# Altium project Diploma.PrjPcb
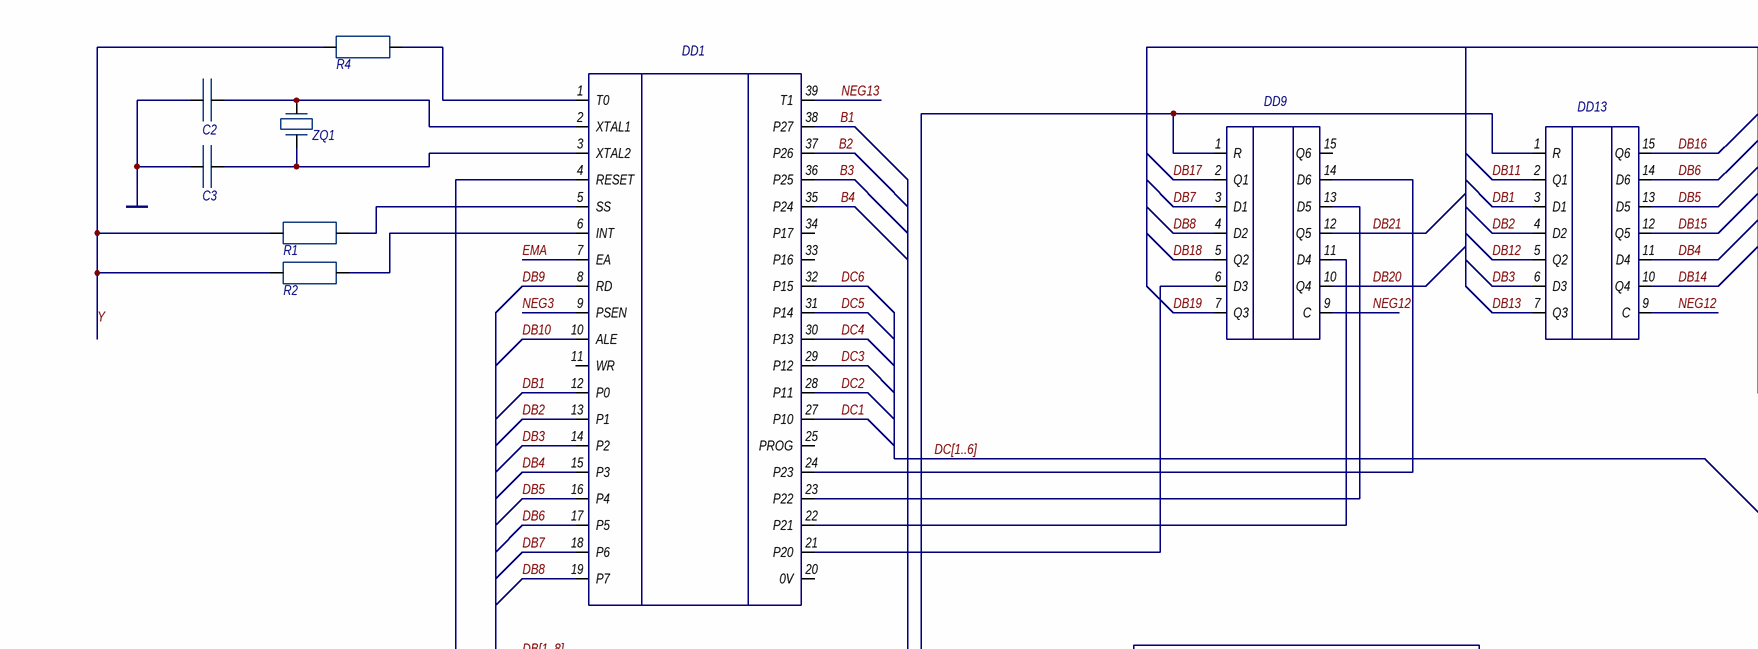
[diagram p0: SHEMPEL.SchDoc, top left]
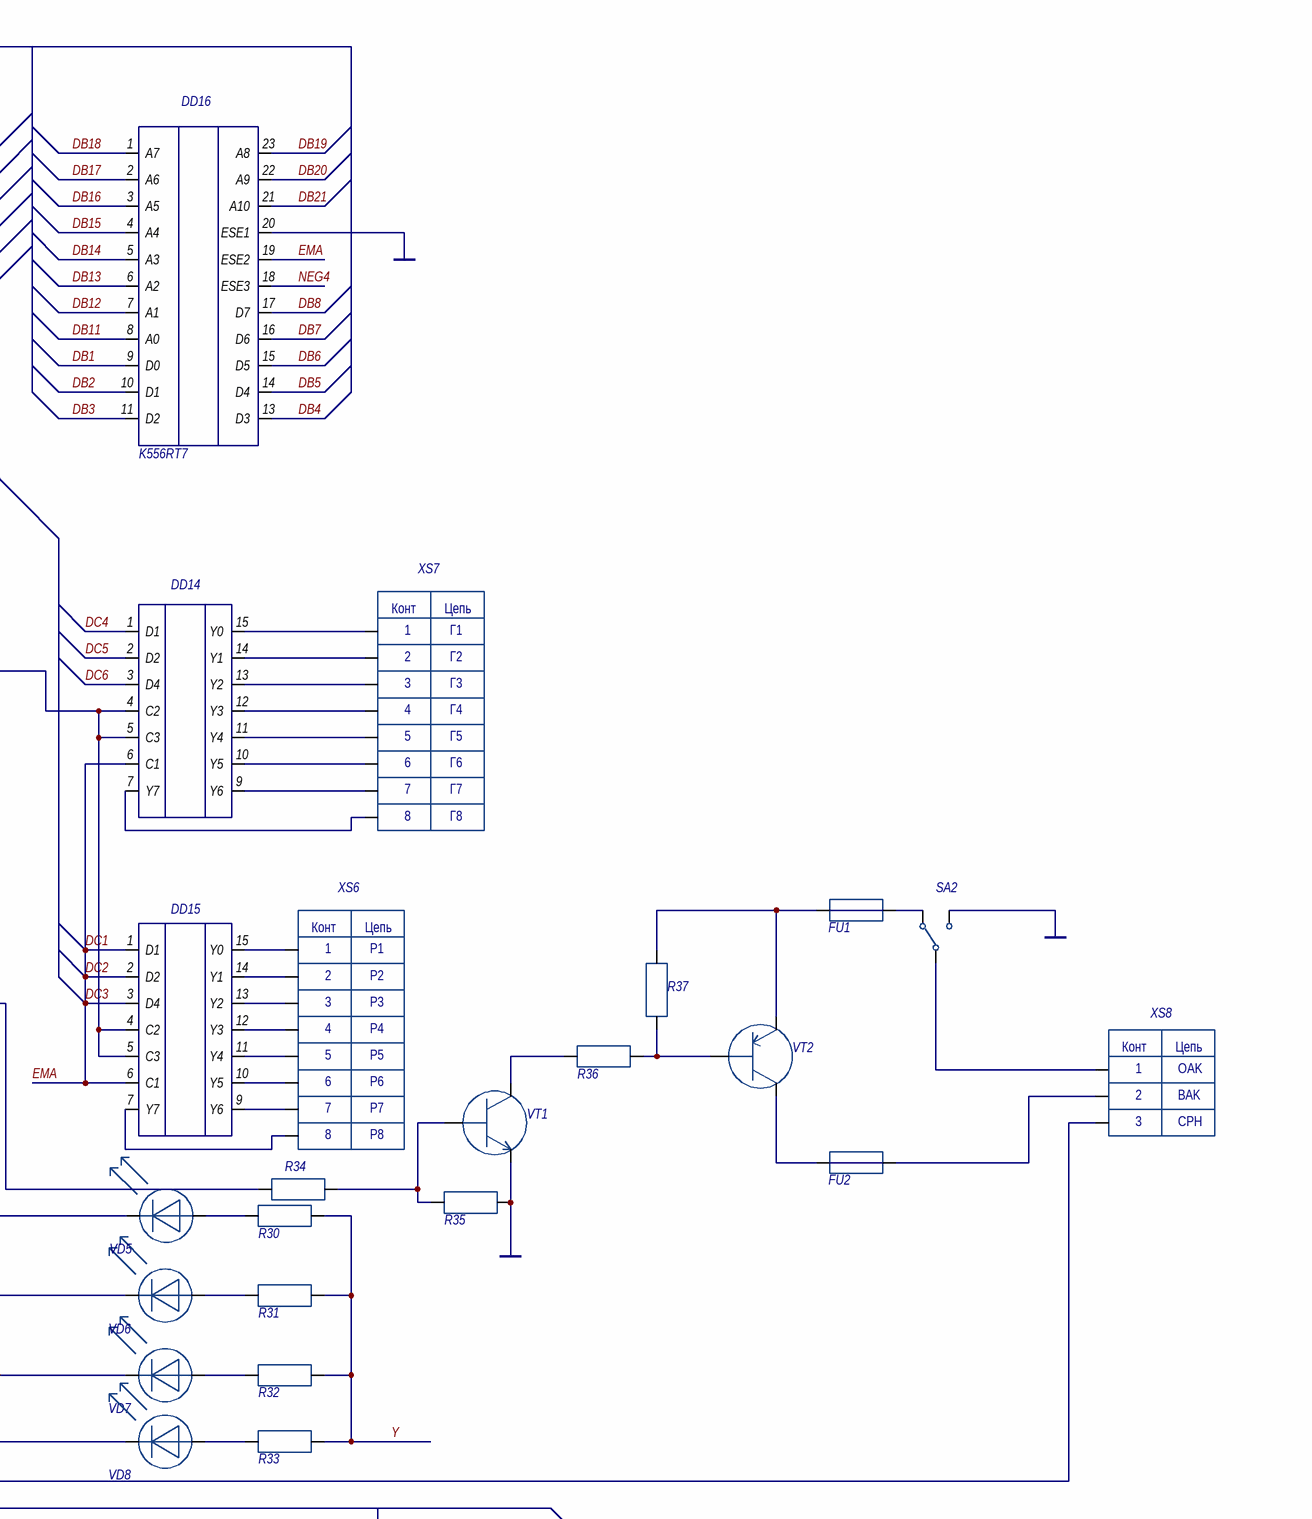
[diagram p1: SHEMPEL.SchDoc, top right]
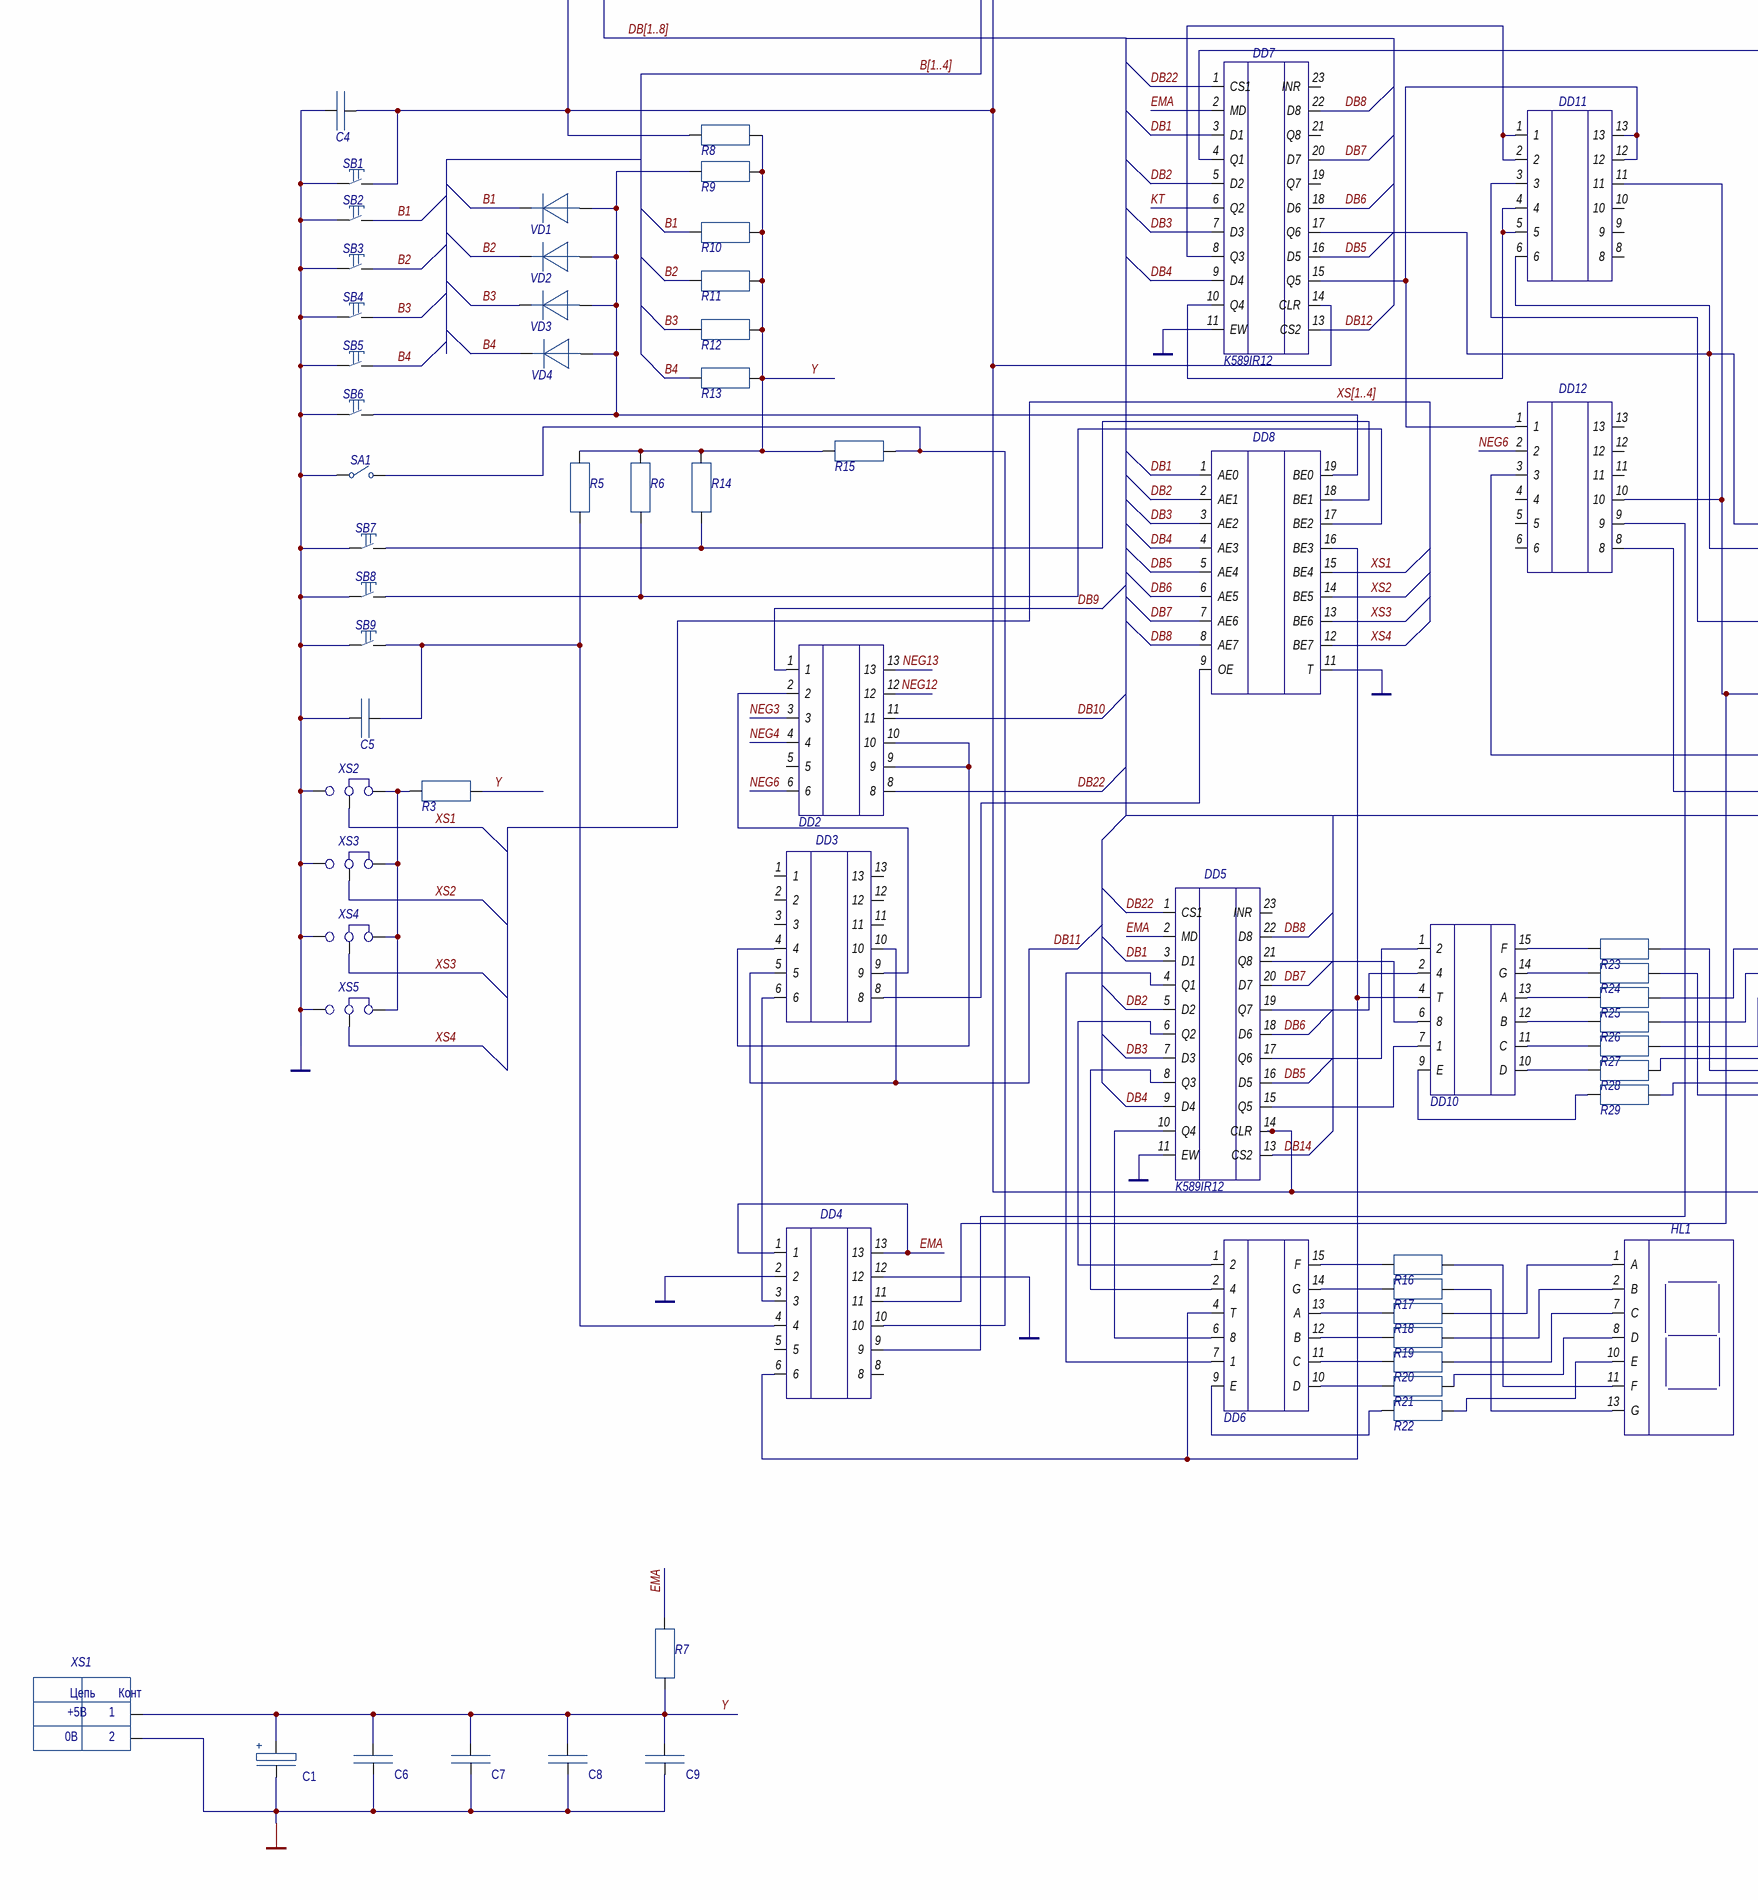
[diagram p2: SHEMPEL.SchDoc, bottom left]
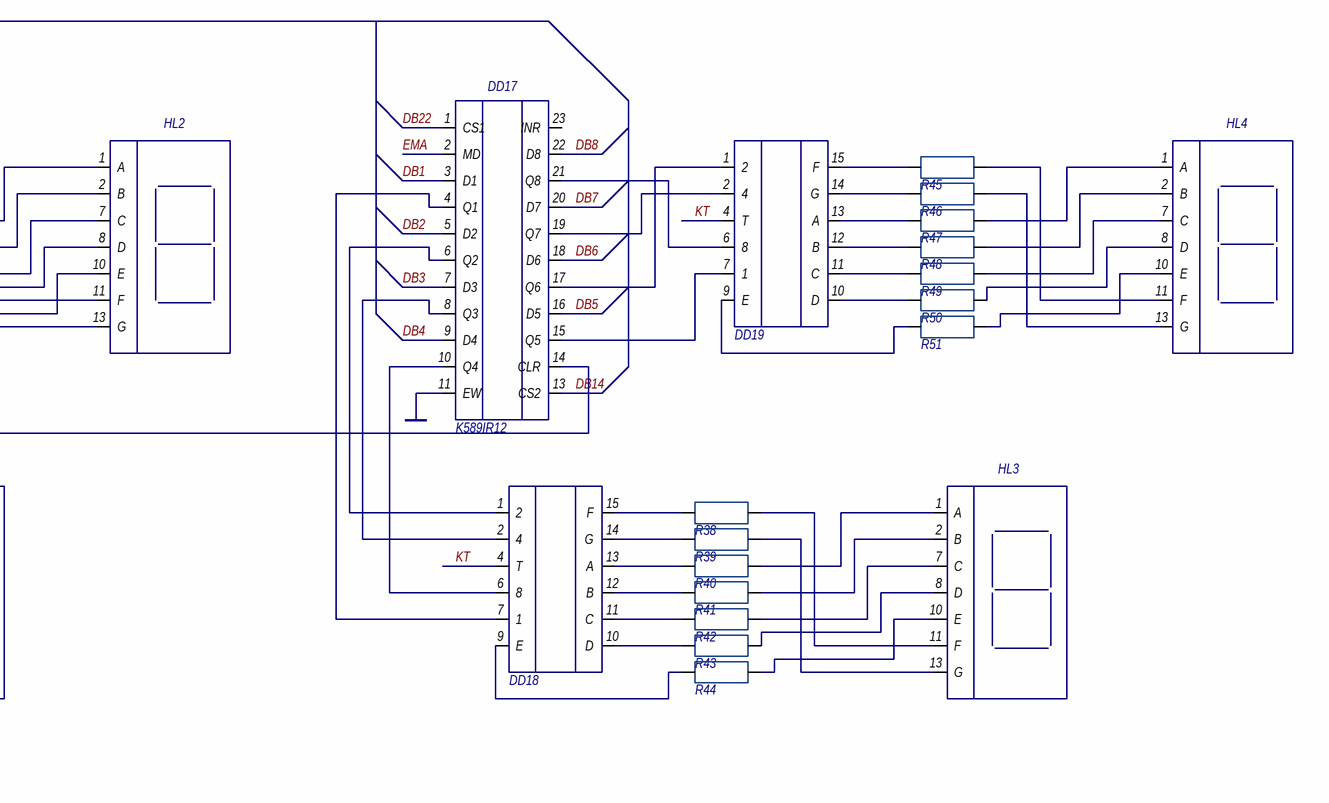
[diagram p3: SHEMPEL.SchDoc, bottom right]
1 sheet, 115 parts. Net scope: global (net labels, ports and power ports of the same name join across sheets).
Board file: main.PcbDoc

## Sheet SHEMPEL.SchDoc
size 840 x 594 mm; ListNumber: 1

### Parts
C1  pol_1mkF  [PCAP_6_3x11THRU-ELECT_NCA]  (value not drawn)
C2  33pF  [CAP_0805_GRM]  (value not drawn)
C3  33pF  [CAP_0805_GRM]  (value not drawn)
C4  33pF  [CAP_0805_GRM]  (value not drawn)
C5  33pF  [CAP_0805_GRM]  (value not drawn)
C6  cap_1mkF  [CAP_0805_GRM]  (value not drawn)
C7  cap_1mkF  [CAP_0805_GRM]  (value not drawn)
C8  cap_1mkF  [CAP_0805_GRM]  (value not drawn)
C9  cap_1mkF  [CAP_0805_GRM]  (value not drawn)
DD1  KR1850VE35  [DIP-40]  (value not drawn)
DD2  K533LN1  [SO-14-K533LA3]  (value not drawn)
DD3  K533LA3  [SO-14-K533LA3]  (value not drawn)
DD4  KR1533TM2  [dip-14]  (value not drawn)
DD5  K589IR12  [DIP-24-KR556RT7]
DD6  K514ID2  [dip-14]  (value not drawn)
DD7  K589IR12  [DIP-24-KR556RT7]
DD8  KR580BA86  [DIP-20]  (value not drawn)
DD9  KR1533TM9  [DIP-16]  (value not drawn)
DD10  K514ID2  [dip-14]  (value not drawn)
DD11  KR1533LA9  [dip-14]  (value not drawn)
DD12  KR1533LA9  [dip-14]  (value not drawn)
DD13  KR1533TM9  [DIP-16]  (value not drawn)
DD14  KR1533ID7  [DIP-16]  (value not drawn)
DD15  KR1533ID7  [DIP-16]  (value not drawn)
DD16  K556RT7  [DIP-24-KR556RT7]
DD17  K589IR12  [DIP-24-KR556RT7]
DD18  K514ID2  [dip-14]  (value not drawn)
DD19  K514ID2  [dip-14]  (value not drawn)
FU1  fu  [FERRIT_BEAD_C2012X105N]  (value not drawn)
FU2  fu  [FERRIT_BEAD_C2012X105N]  (value not drawn)
HL1  semisigment  [LDS-C302RI_10P18X19P10_LUM]  (value not drawn)
HL2  semisigment  [LDS-C302RI_10P18X19P10_LUM]  (value not drawn)
HL3  semisigment  [LDS-C302RI_10P18X19P10_LUM]  (value not drawn)
HL4  semisigment  [LDS-C302RI_10P18X19P10_LUM]  (value not drawn)
R1  res_510  [RES_RC0805]  (value not drawn)
R2  res_510  [RES_RC0805]  (value not drawn)
R3  res_510  [RES_RC0805]  (value not drawn)
R4  res_510  [RES_RC0805]  (value not drawn)
R5  res_510  [RES_RC0805]  (value not drawn)
R6  res_510  [RES_RC0805]  (value not drawn)
R7  res_510  [RES_RC0805]  (value not drawn)
R8  res_510  [RES_RC0805]  (value not drawn)
R9  res_510  [RES_RC0805]  (value not drawn)
R10  res_510  [RES_RC0805]  (value not drawn)
R11  res_510  [RES_RC0805]  (value not drawn)
R12  res_510  [RES_RC0805]  (value not drawn)
R13  res_510  [RES_RC0805]  (value not drawn)
R14  res_510  [RES_RC0805]  (value not drawn)
R15  res_510  [RES_RC0805]  (value not drawn)
R16  res_510  [RES_RC0805]  (value not drawn)
R17  res_510  [RES_RC0805]  (value not drawn)
R18  res_510  [RES_RC0805]  (value not drawn)
R19  res_510  [RES_RC0805]  (value not drawn)
R20  res_510  [RES_RC0805]  (value not drawn)
R21  res_510  [RES_RC0805]  (value not drawn)
R22  res_510  [RES_RC0805]  (value not drawn)
R23  res_510  [RES_RC0805]  (value not drawn)
R24  res_510  [RES_RC0805]  (value not drawn)
R25  res_510  [RES_RC0805]  (value not drawn)
R26  res_510  [RES_RC0805]  (value not drawn)
R27  res_510  [RES_RC0805]  (value not drawn)
R28  res_510  [RES_RC0805]  (value not drawn)
R29  res_510  [RES_RC0805]  (value not drawn)
R30  res_510  [RES_RC0805]  (value not drawn)
R31  res_510  [RES_RC0805]  (value not drawn)
R32  res_510  [RES_RC0805]  (value not drawn)
R33  res_510  [RES_RC0805]  (value not drawn)
R34  res_510  [RES_RC0805]  (value not drawn)
R35  res_510  [RES_RC0805]  (value not drawn)
R36  res_510  [RES_RC0805]  (value not drawn)
R37  res_510  [RES_RC0805]  (value not drawn)
R38  res_510  [RES_RC0805]  (value not drawn)
R39  res_510  [RES_RC0805]  (value not drawn)
R40  res_510  [RES_RC0805]  (value not drawn)
R41  res_510  [RES_RC0805]  (value not drawn)
R42  res_510  [RES_RC0805]  (value not drawn)
R43  res_510  [RES_RC0805]  (value not drawn)
R44  res_510  [RES_RC0805]  (value not drawn)
R45  res_510  [RES_RC0805]  (value not drawn)
R46  res_510  [RES_RC0805]  (value not drawn)
R47  res_510  [RES_RC0805]  (value not drawn)
R48  res_510  [RES_RC0805]  (value not drawn)
R49  res_510  [RES_RC0805]  (value not drawn)
R50  res_510  [RES_RC0805]  (value not drawn)
R51  res_510  [RES_RC0805]  (value not drawn)
SA1  sw-spst  [SW-SPST]  (value not drawn)
SA2  sw-spdt  [SW-SPDT]  (value not drawn)
SB1  button_keypad  [button_SW_1571527-1]  (value not drawn)
SB2  button_keypad  [button_SW_1571527-1]  (value not drawn)
SB3  button_keypad  [button_SW_1571527-1]  (value not drawn)
SB4  button_keypad  [button_SW_1571527-1]  (value not drawn)
SB5  button_keypad  [button_SW_1571527-1]  (value not drawn)
SB6  button_keypad  [button_SW_1571527-1]  (value not drawn)
SB7  button_keypad  [button_SW_1571527-1]  (value not drawn)
SB8  button_keypad  [button_SW_1571527-1]  (value not drawn)
SB9  button_keypad  [button_SW_1571527-1]  (value not drawn)
VD1  M7  [M7_DO-214AC_DTC]  (value not drawn)
VD2  M7  [M7_DO-214AC_DTC]  (value not drawn)
VD3  M7  [M7_DO-214AC_DTC]  (value not drawn)
VD4  M7  [M7_DO-214AC_DTC]  (value not drawn)
VD5  red_GNL-3012HD  [LED_151054RS03000]  (value not drawn)
VD6  red_GNL-3012HD  [LED_151054RS03000]  (value not drawn)
VD7  red_GNL-3012HD  [LED_151054RS03000]  (value not drawn)
VD8  red_GNL-3012HD  [LED_151054RS03000]  (value not drawn)
VT1  BC547  [TO-92-3_ONS]  (value not drawn)
VT2  trans  [TO-92-3_ONS]  (value not drawn)
XS1  conn_power_jack  [PJ-037AH]  (value not drawn)
XS2  switcher  [conn_3pin_TSW-103-05-G-S]  (value not drawn)
XS3  switcher  [conn_3pin_TSW-103-05-G-S]  (value not drawn)
XS4  switcher  [conn_3pin_TSW-103-05-G-S]  (value not drawn)
XS5  switcher  [conn_3pin_TSW-103-05-G-S]  (value not drawn)
XS6  conn_8pin_P  [conn_8pin_TSW-108-05-G-S]  (value not drawn)
XS7  conn_8_pin_G  [conn_8pin_TSW-108-05-G-S]  (value not drawn)
XS8  conn_3_OAK_BAK_CPH  [conn_3pin_TSW-103-05-G-S]  (value not drawn)
ZQ1  HC-49S  [CRYSTAL_HC49S_MTC]  (value not drawn)

### Nets
GND: C1.1 C2.1 C3.1 C4.1 C5.1 C6.1 C7.1 C8.1 C9.1 DD4.2 DD4.12 DD5.11(EW) DD7.11(EW) DD8.11(T) DD16.20(ESE1) DD17.11(EW) R35.2 SA1.1 SA2.1 SB1.1 SB2.1 SB3.1 SB4.1 SB5.1 SB6.1 SB7.1 SB8.1 SB9.1 VT1.1(E) XS1.2(VDD) XS2.1 XS3.1 XS4.1 XS5.1
B1: DD1.38(P27) R10.1 SB2.2 VD1.2
B2: DD1.37(P26) R11.1 SB3.2 VD2.2
B3: DD1.36(P25) R12.1 SB4.2 VD3.2
B4: DD1.35(P24) R13.1 SB5.2 VD4.2
DB1: DD1.12(P0) DD5.3(D1) DD7.3(D1) DD8.1(AE0) DD13.3(D1) DD16.9(D0) DD17.3(D1)
DB2: DD1.13(P1) DD5.5(D2) DD7.5(D2) DD8.2(AE1) DD13.4(D2) DD16.10(D1) DD17.5(D2)
DB3: DD1.14(P2) DD5.7(D3) DD7.7(D3) DD8.3(AE2) DD13.6(D3) DD16.11(D2) DD17.7(D3)
DB4: DD1.15(P3) DD5.9(D4) DD7.9(D4) DD8.4(AE3) DD13.11(D4) DD16.13(D3) DD17.9(D4)
DB5: DD1.16(P4) DD5.16(D5) DD7.16(D5) DD8.5(AE4) DD13.13(D5) DD16.14(D4) DD17.16(D5)
DB6: DD1.17(P5) DD5.18(D6) DD7.18(D6) DD8.6(AE5) DD13.14(D6) DD16.15(D5) DD17.18(D6)
DB7: DD1.18(P6) DD5.20(D7) DD7.20(D7) DD8.7(AE6) DD9.3(D1) DD16.16(D6) DD17.20(D7)
DB8: DD1.19(P7) DD5.22(D8) DD7.22(D8) DD8.8(AE7) DD9.4(D2) DD16.17(D7) DD17.22(D8)
DB9: DD1.8(RD) DD2.1
DB10: DD1.10(ALE) DD2.11
DB11: DD3.5 DD3.10 DD13.2(Q1) DD16.8(A0)
DB12: DD7.13(CS2) DD13.5(Q2) DD16.7(A1)
DB13: DD13.7(Q3) DD16.6(A2)
DB14: DD5.13(CS2) DD13.10(Q4) DD16.5(A3) DD17.13(CS2)
DB15: DD13.12(Q5) DD16.4(A4)
DB16: DD13.15(Q6) DD16.3(A5)
DB17: DD9.2(Q1) DD16.2(A6)
DB18: DD9.5(Q2) DD16.1(A7)
DB19: DD9.7(Q3) DD16.23(A8)
DB20: DD9.10(Q4) DD16.22(A9)
DB21: DD9.12(Q5) DD16.21(A10)
DB22: DD2.8 DD5.1(CS1) DD7.1(CS1) DD17.1(CS1)
DC1: DD1.7(EA) DD1.27(P10) DD1.28(P11) DD1.29(P12) DD4.1 DD4.13 DD5.2(MD) DD7.2(MD) DD14.6(C1) DD15.1(D1) DD15.2(D2) DD15.3(D4) DD15.6(C1) DD16.19(ESE2) DD17.2(MD) R7.2  [also labelled DC2, DC3, EMA]
DC4: DD1.30(P13) DD14.1(D1)
DC5: DD1.31(P14) DD14.2(D2)
DC6: DD1.32(P15) DD14.3(D4)
KT: DD7.6(Q2) DD18.4(T) DD19.4(T)
NEG3: DD1.9(PSEN) DD2.3
NEG4: DD2.4 DD16.18(ESE3)
NEG6: DD2.6 DD12.2
NEG12: DD2.12 DD9.9(C) DD13.9(C)
NEG13: DD1.39(T1) DD2.13
XS1: DD8.15(BE4) XS2.3
XS2: DD8.14(BE5) XS3.3
XS3: DD8.13(BE6) XS4.3
XS4: DD8.12(BE7) XS5.3
Y: C1.2 C6.2 C7.2 C8.2 C9.2 R1.1 R2.1 R3.2 R4.1 R5.2 R6.2 R7.1 R8.2 R9.2 R10.2 R11.2 R12.2 R13.2 R14.2 R15.1 R30.2 R31.2 R32.2 R33.2 XS1.1(VSS)
NetC2_2: C2.2 DD1.2(XTAL1) ZQ1.2
NetC3_2: C3.2 DD1.3(XTAL2) ZQ1.1
NetC4_2: C4.2 DD1.4(RESET) DD5.14(CLR) DD7.14(CLR) DD9.1(R) DD13.1(R) DD17.14(CLR) R8.1 SB1.2
NetC5_2: C5.2 DD4.4 R5.1 SB9.2
NetDD1_1: DD1.1(T0) R4.2
NetDD1_5: DD1.5(SS) R1.2
NetDD1_6: DD1.6(INT) R2.2
NetDD1_21: DD1.21(P20) DD9.6(D3)
NetDD1_22: DD1.22(P21) DD9.11(D4)
NetDD1_23: DD1.23(P22) DD9.13(D5)
NetDD1_24: DD1.24(P23) DD9.14(D6)
NetDD2_2: DD2.2 DD3.9
NetDD2_9: DD2.9 DD2.10 DD3.4
NetDD3_6: DD3.6 DD4.3
NetDD3_8: DD3.8 DD8.9(OE)
NetDD4_6: DD4.6 DD6.4(T) DD8.16(BE3) DD10.4(T)
NetDD4_9: DD4.9 DD12.9
NetDD4_10: DD4.10 R15.2 SA1.2
NetDD4_11: DD4.11 DD11.11 DD12.10 VD7.2
NetDD5_4: DD5.4(Q1) DD6.7(1)
NetDD5_6: DD5.6(Q2) DD6.1(2)
NetDD5_8: DD5.8(Q3) DD6.2(4)
NetDD5_10: DD5.10(Q4) DD6.6(8)
NetDD5_15: DD5.15(Q5) DD10.7(1)
NetDD5_17: DD5.17(Q6) DD10.1(2)
NetDD5_19: DD5.19(Q7) DD10.2(4)
NetDD5_21: DD5.21(Q8) DD10.6(8)
NetDD6_9: DD6.9(E) R22.1
NetDD6_10: DD6.10(D) R21.1
NetDD6_11: DD6.11(C) R20.1
NetDD6_12: DD6.12(B) R19.1
NetDD6_13: DD6.13(A) R18.1
NetDD6_14: DD6.14(G) R17.1
NetDD6_15: DD6.15(F) R16.1
NetDD7_4: DD7.4(Q1) DD14.4(C2) DD14.5(C3) DD15.4(C2) DD15.5(C3)
NetDD7_8: DD7.8(Q3) DD11.1 DD11.2
NetDD7_10: DD7.10(Q4) DD11.4 DD11.5
NetDD7_15: DD7.15(Q5) DD11.12 DD11.13 DD12.1
NetDD7_17: DD7.17(Q6) DD11.6 R34.1 VD5.2
NetDD8_17: DD8.17(BE2) R6.1 SB8.2
NetDD8_18: DD8.18(BE1) R14.1 SB7.2
NetDD8_19: DD8.19(BE0) R9.1 SB6.2 VD1.1 VD2.1 VD3.1 VD4.1
NetDD10_9: DD10.9(E) R29.1
NetDD10_10: DD10.10(D) R28.1
NetDD10_11: DD10.11(C) R27.1
NetDD10_12: DD10.12(B) R26.1
NetDD10_13: DD10.13(A) R25.1
NetDD10_14: DD10.14(G) R24.1
NetDD10_15: DD10.15(F) R23.1
NetDD11_3: DD11.3 VD6.2
NetDD12_3: DD12.3 VD8.2
NetDD12_8: DD12.8 XS8.3
NetDD14_7: DD14.7(Y7) XS7.8
NetDD14_9: DD14.9(Y6) XS7.7(D0)
NetDD14_10: DD14.10(Y5) XS7.6(*WR)
NetDD14_11: DD14.11(Y4) XS7.5(*RD)
NetDD14_12: DD14.12(Y3) XS7.4(C/D)
NetDD14_13: DD14.13(Y2) XS7.3(VO)
NetDD14_14: DD14.14(Y1) XS7.2(VDD)
NetDD14_15: DD14.15(Y0) XS7.1(VSS)
NetDD15_7: DD15.7(Y7) XS6.8
NetDD15_9: DD15.9(Y6) XS6.7(D0)
NetDD15_10: DD15.10(Y5) XS6.6(*WR)
NetDD15_11: DD15.11(Y4) XS6.5(*RD)
NetDD15_12: DD15.12(Y3) XS6.4(C/D)
NetDD15_13: DD15.13(Y2) XS6.3(VO)
NetDD15_14: DD15.14(Y1) XS6.2(VDD)
NetDD15_15: DD15.15(Y0) XS6.1(VSS)
NetDD17_4: DD17.4(Q1) DD18.7(1)
NetDD17_6: DD17.6(Q2) DD18.1(2)
NetDD17_8: DD17.8(Q3) DD18.2(4)
NetDD17_10: DD17.10(Q4) DD18.6(8)
NetDD17_15: DD17.15(Q5) DD19.7(1)
NetDD17_17: DD17.17(Q6) DD19.1(2)
NetDD17_19: DD17.19(Q7) DD19.2(4)
NetDD17_21: DD17.21(Q8) DD19.6(8)
NetDD18_9: DD18.9(E) R44.1
NetDD18_10: DD18.10(D) R43.1
NetDD18_11: DD18.11(C) R42.1
NetDD18_12: DD18.12(B) R41.1
NetDD18_13: DD18.13(A) R40.1
NetDD18_14: DD18.14(G) R39.1
NetDD18_15: DD18.15(F) R38.1
NetDD19_9: DD19.9(E) R51.1
NetDD19_10: DD19.10(D) R50.1
NetDD19_11: DD19.11(C) R49.1
NetDD19_12: DD19.12(B) R48.1
NetDD19_13: DD19.13(A) R47.1
NetDD19_14: DD19.14(G) R46.1
NetDD19_15: DD19.15(F) R45.1
NetFU1_1: FU1.1 R37.2 VT2.3(C)
NetFU1_2: FU1.2 SA2.3
NetFU2_1: FU2.1 VT2.1(E)
NetFU2_2: FU2.2 XS8.2(VDD)
NetHL1_1: HL1.1(A) R18.2
NetHL1_2: HL1.2(B) R19.2
NetHL1_7: HL1.7(C) R20.2
NetHL1_8: HL1.8(D) R21.2
NetHL1_10: HL1.10(E) R22.2
NetHL1_11: HL1.11(F) R16.2
NetHL1_13: HL1.13(G) R17.2
NetHL2_1: HL2.1(A) R25.2
NetHL2_2: HL2.2(B) R26.2
NetHL2_7: HL2.7(C) R27.2
NetHL2_8: HL2.8(D) R28.2
NetHL2_10: HL2.10(E) R29.2
NetHL2_11: HL2.11(F) R23.2
NetHL2_13: HL2.13(G) R24.2
NetHL3_1: HL3.1(A) R40.2
NetHL3_2: HL3.2(B) R41.2
NetHL3_7: HL3.7(C) R42.2
NetHL3_8: HL3.8(D) R43.2
NetHL3_10: HL3.10(E) R44.2
NetHL3_11: HL3.11(F) R38.2
NetHL3_13: HL3.13(G) R39.2
NetHL4_1: HL4.1(A) R47.2
NetHL4_2: HL4.2(B) R48.2
NetHL4_7: HL4.7(C) R49.2
NetHL4_8: HL4.8(D) R50.2
NetHL4_10: HL4.10(E) R51.2
NetHL4_11: HL4.11(F) R45.2
NetHL4_13: HL4.13(G) R46.2
NetR3_1: R3.1 XS2.2 XS3.2 XS4.2 XS5.2
NetR30_1: R30.1 VD5.1
NetR31_1: R31.1 VD6.1
NetR32_1: R32.1 VD7.1
NetR33_1: R33.1 VD8.1
NetR34_2: R34.2 R35.1 VT1.2(B)
NetR36_1: R36.1 VT1.3(C)
NetR36_2: R36.2 R37.1 VT2.2(B)
NetSA2_2: SA2.2 XS8.1(VSS)

Not connected (* = marked no-connect by the designer): DD1 11(WR) 20(0V) 25(PROG) 26(GND) 33(P16) 34(P17) 40(Ucc); DD2 5 7(GND) 14(Ucc); DD3 1 2 3 11 12 13; DD4 5 8; DD5 12(GND) 23(INR) 24(Ucc); DD6 8(GND) 16(Ucc); DD7 12(GND) 19(Q7) 21(Q8) 23(INR) 24(Ucc); DD8 10(GND) 20(Ucc); DD9 8(GND) 15(Q6) 16(Vcc); DD10 8(GND) 16(Ucc); DD11 8 9 10; DD12 4 5 6 11 12 13; DD13 8(GND) 16(Vcc); DD14 8(GND) 16(VCC); DD15 8(GND) 16(VCC); DD16 12(GND) 24(Ucc); DD17 12(GND) 23(INR) 24(Ucc); DD18 8(GND) 16(Ucc); DD19 8(GND) 16(Ucc); HL1 3(Ucc) 9(Ucc) 14(Ucc); HL2 3(Ucc) 9(Ucc) 14(Ucc); HL3 3(Ucc) 9(Ucc) 14(Ucc); HL4 3(Ucc) 9(Ucc) 14(Ucc)

### Buses and harness runs
bus B[1..4]
bus DB[1..8]
bus DC[1..6]
bus XS[1..4]

### Notes on the sheet
- Перв. примен.
- Справ. №
- Подп. и дата
- Инв. № дубл.
- Взам. инв. №
- Разраб.
- Изм.
- Лист
- № докум.
- Подп.
- Дата
- Лит.
- Масса
- Масштаб
- Пров.
- Т. контр.
- Листов
- Инв. № подл.
- Н. контр.
- Утв.
- Копировал
- Формат А1
- (in symbol conn_3_OAK_BAK_CPH) Конт; Цепь; OAK; BAK; CPH
- (in symbol conn_8_pin_G) Конт; Цепь; Г1; Г2; Г3; Г4; Г5; Г6; Г7; Г8
- (in symbol conn_8pin_P) Конт; Цепь; Р1; Р2; Р3; Р4; Р5; Р6; Р7; Р8
- (in symbol conn_power_jack) Цепь; Конт; +5В; 0В

### Library data of the parts
C1 = cap_pol_10mkF_15v
C2-C5 = cap_33pF
VD1-VD4 = diode_M7
VD5-VD8 = diode_red
VT1 = trans_BC547
ZQ1 = crystal_8mhz